# EAGLE design Sram2FramAdapter (EAGLE 7.6.0)
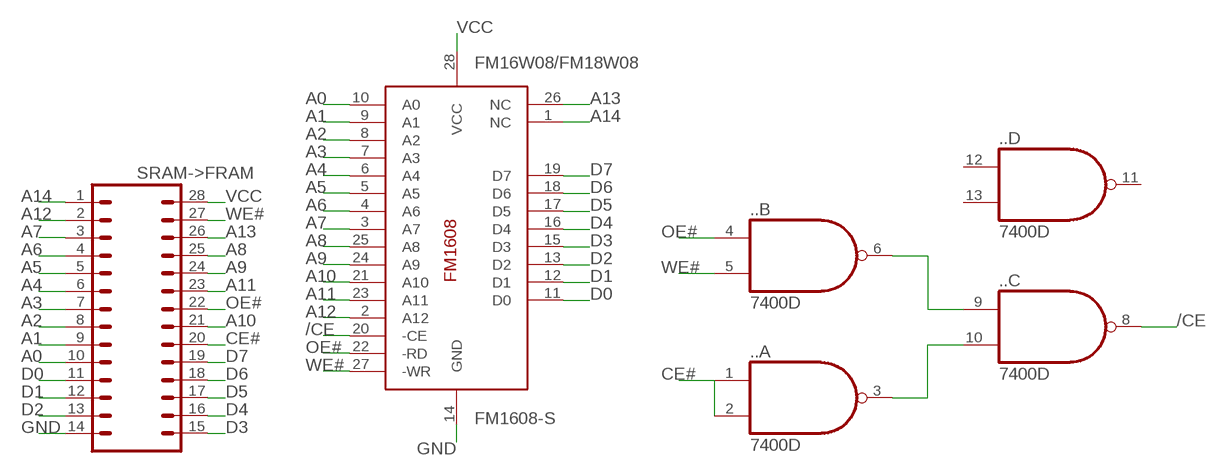
[diagram p0: schematic, sheet 1]

## Parts
..  7400D  [SO14]
FM16W08/FM18W08  FM1608-S  [SO-28W]
SRAM->FRAM  DIP28PTH  [DIP28]

## Nets
/CE: ...8(C:O) FM16W08/FM18W08.20(-CE)
A0: FM16W08/FM18W08.10(A0) SRAM->FRAM.10
A1: FM16W08/FM18W08.9(A1) SRAM->FRAM.9
A2: FM16W08/FM18W08.8(A2) SRAM->FRAM.8
A3: FM16W08/FM18W08.7(A3) SRAM->FRAM.7
A4: FM16W08/FM18W08.6(A4) SRAM->FRAM.6
A5: FM16W08/FM18W08.5(A5) SRAM->FRAM.5
A6: FM16W08/FM18W08.4(A6) SRAM->FRAM.4
A7: FM16W08/FM18W08.3(A7) SRAM->FRAM.3
A8: FM16W08/FM18W08.25(A8) SRAM->FRAM.25
A9: FM16W08/FM18W08.24(A9) SRAM->FRAM.24
A10: FM16W08/FM18W08.21(A10) SRAM->FRAM.21
A11: FM16W08/FM18W08.23(A11) SRAM->FRAM.23
A12: FM16W08/FM18W08.2(A12) SRAM->FRAM.2
A13: FM16W08/FM18W08.26(NC) SRAM->FRAM.26
A14: FM16W08/FM18W08.1(NC) SRAM->FRAM.1
CE#: ...1(A:I0) ...2(A:I1) SRAM->FRAM.20
D0: FM16W08/FM18W08.11(D0) SRAM->FRAM.11
D1: FM16W08/FM18W08.12(D1) SRAM->FRAM.12
D2: FM16W08/FM18W08.13(D2) SRAM->FRAM.13
D3: FM16W08/FM18W08.15(D3) SRAM->FRAM.15
D4: FM16W08/FM18W08.16(D4) SRAM->FRAM.16
D5: FM16W08/FM18W08.17(D5) SRAM->FRAM.17
D6: FM16W08/FM18W08.18(D6) SRAM->FRAM.18
D7: FM16W08/FM18W08.19(D7) SRAM->FRAM.19
GND: FM16W08/FM18W08.14(GND) SRAM->FRAM.14
N$3: ...6(B:O) ...9(C:I0)
N$4: ...3(A:O) ...10(C:I1)
OE#: ...4(B:I0) FM16W08/FM18W08.22(-RD) SRAM->FRAM.22
VCC: FM16W08/FM18W08.28(VCC) SRAM->FRAM.28
WE#: ...5(B:I1) FM16W08/FM18W08.27(-WR) SRAM->FRAM.27
Unconnected: ...11(D:O) ...12(D:I0) ...13(D:I1)

## Power pins joined to a net without a drawn wire
GND: ...7(P:GND)
VCC: ...14(P:VCC)

## Library data of the parts
.. = 74xx-us:74*00: Quad 2-input NAND gate
FM16W08/FM18W08 = ramtron:FM1608: FM1608 8k x 8 NVRAM 5V (Jedec) DIP/SO-28W
SRAM->FRAM = Adapter_DIP28:DIP28: 1x16 .1" header

## Board
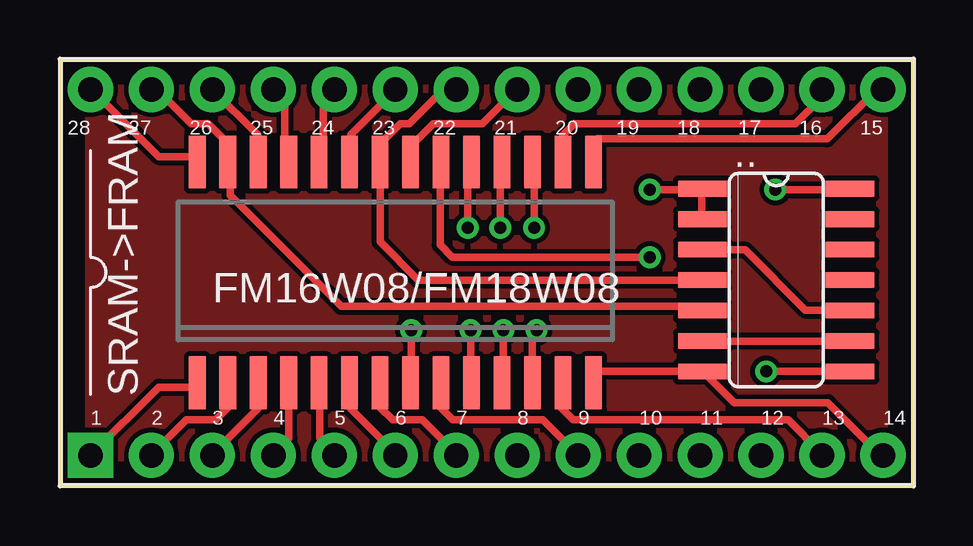
[diagram p1: board, top side]
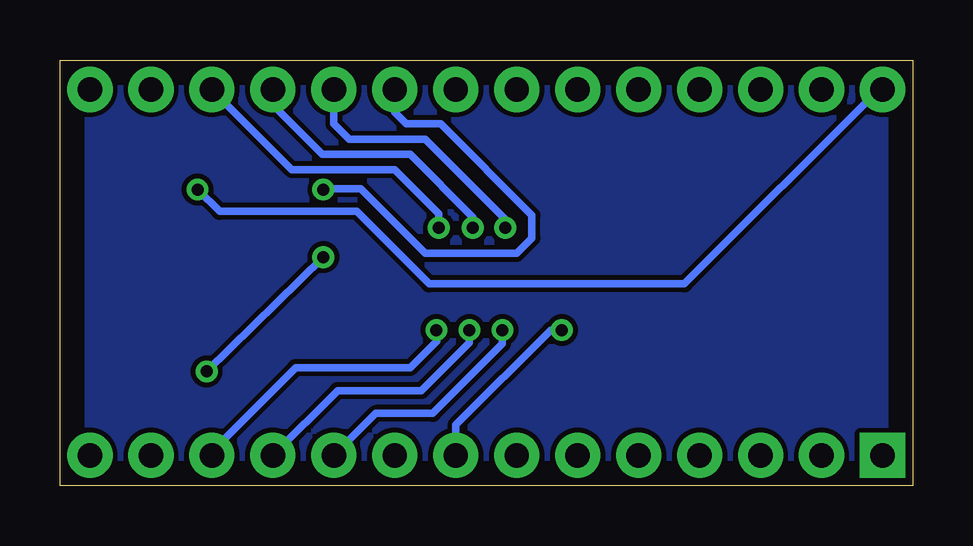
[diagram p2: board, bottom side, seen from below]

Size 35.54 x 17.74 mm. Coordinates in mm from the lower left corner, seen from the top.
Outline: 0,0 35.54,0 35.54,17.74 0,17.74 0,0
Copper layers (1*16): Top 0.035mm / dielectric 1.5mm / Bottom 0.035mm
Design rules "default": minimum track width 10mil, minimum drill 24mil, track to track 8mil, track to pad 8mil, pad to pad 8mil, via to via 8mil, smd to smd 8mil, copper to edge 40mil, drill to drill 8mil, minimum pad ring 10mil, minimum via ring 8mil, stop-mask expansion 4mil, vias tented up to drill 0mil, thermal gap 10mil

### Footprints (pad centres in the part's own frame; a part is rotated, then mirrored left to right if it is on the bottom)
SO14 = smd 0.66 x 2.032: 1 -3.81,-3.073; 2 -2.54,-3.073; 3 -1.27,-3.073; 4 0,-3.073; 5 1.27,-3.073; 6 2.54,-3.073; 7 3.81,-3.073; 8 3.81,3.073; 9 2.54,3.073; 10 1.27,3.073; 11 0,3.073; 12 -1.27,3.073; 13 -2.54,3.073; 14 -3.81,3.073
SO-28W = smd 0.7 x 2.2: 1 -8.255,-4.6; 2 -6.985,-4.6; 3 -5.715,-4.6; 4 -4.445,-4.6; 5 -3.175,-4.6; 6 -1.905,-4.6; 7 -0.635,-4.6; 8 0.635,-4.6; 9 1.905,-4.6; 10 3.175,-4.6; 11 4.445,-4.6; 12 5.715,-4.6; 13 6.985,-4.6; 14 8.255,-4.6; 15 8.255,4.6; 16 6.985,4.6; 17 5.715,4.6; 18 4.445,4.6; 19 3.175,4.6; 20 1.905,4.6; 21 0.635,4.6; 22 -0.635,4.6; 23 -1.905,4.6; 24 -3.175,4.6; 25 -4.445,4.6; 26 -5.715,4.6; 27 -6.985,4.6; 28 -8.255,4.6
DIP28 = drill 1.016 pad 1.88 square: 1 0,0 | drill 1.016 pad 1.88: 2 2.54,0; 3 5.08,0; 4 7.62,0; 5 10.16,0; 6 12.7,0; 7 15.24,0; 8 17.78,0; 9 20.32,0; 10 22.86,0; 11 25.4,0; 12 27.94,0; 13 30.48,0; 14 33.02,0; 15 33.02,15.24; 16 30.48,15.24; 17 27.94,15.24; 18 25.4,15.24; 19 22.86,15.24; 20 20.32,15.24; 21 17.78,15.24; 22 15.24,15.24; 23 12.7,15.24; 24 10.16,15.24; 25 7.62,15.24; 26 5.08,15.24; 27 2.54,15.24; 28 0,15.24

### Placement (x,y rotation side)
..  29.84,8.57 270 top
FM16W08/FM18W08  13.97,8.89 0 top
SRAM->FRAM  1.27,1.27 0 top

### Tracks (layer width: path | path; a pad name or v marks a point on that pad's centre or on a via)
/CE  (via drill 0.5)
  Top 0.305: FM16W08/FM18W08.20 15.84,13.49 15.84,10.03 16.35,9.53 v24.57,9.53 | v29.43,4.76 ...8
  Bottom 0.305: v24.57,9.53 v29.43,4.76
A0  (via drill 0.5)
  Top 0.305: FM16W08/FM18W08.10 17.11,4.29 v17.11,6.49
  Bottom 0.305: v17.11,6.49 17.11,5.91 20,3.02 22.38,3.02 SRAM->FRAM.10
A1
  Top 0.305: SRAM->FRAM.9 20.12,2.74 16.37,2.74 15.84,3.27 15.84,4.27 FM16W08/FM18W08.9
A2  (via drill 0.5)
  Top 0.305: v14.63,6.49 14.63,4.34 FM16W08/FM18W08.8
  Bottom 0.305: v14.63,6.49 15.1,6.49 19.05,2.54 SRAM->FRAM.8
A3
  Top 0.305: FM16W08/FM18W08.7 13.33,3.48 13.33,3.27 13.86,2.74 15.09,2.74 16.46,1.37 SRAM->FRAM.7
A4
  Top 0.305: FM16W08/FM18W08.6 12.12,4.12 12.12,3.2 13.95,1.37 SRAM->FRAM.6
A5
  Top 0.305: FM16W08/FM18W08.5 10.81,4.12 10.81,1.99 11.43,1.37 SRAM->FRAM.5
A6
  Top 0.305: FM16W08/FM18W08.4 9.53,4.12 9.53,1.99 8.91,1.37 SRAM->FRAM.4
A7
  Top 0.305: FM16W08/FM18W08.3 8.23,4.12 8.23,3.2 6.4,1.37 SRAM->FRAM.3
A8
  Top 0.305: FM16W08/FM18W08.25 9.37,13.72 9.37,16 8.91,16.46 SRAM->FRAM.25
A9
  Top 0.305: FM16W08/FM18W08.24 10.97,13.72 10.97,16 11.43,16.46 SRAM->FRAM.24
A10
  Top 0.305: FM16W08/FM18W08.21 14.63,13.72 14.63,14.17 15.54,15.09 17.6,15.09 18.97,16.46 SRAM->FRAM.21
A11
  Top 0.305: FM16W08/FM18W08.23 12.12,13.72 12.12,14.63 13.95,16.46 SRAM->FRAM.23
A12
  Top 0.305: FM16W08/FM18W08.2 6.86,4.12 7.02,3.27 6.49,2.74 5.26,2.74 3.89,1.37 SRAM->FRAM.2
A13
  Top 0.305: SRAM->FRAM.26 8.23,14.63 8.23,13.72 FM16W08/FM18W08.26
A14
  Top 0.305: SRAM->FRAM.1 4.12,4.12 5.71,4.12 FM16W08/FM18W08.1
CE#  (via drill 0.5)
  Top 0.305: 26.75,12.34 26.75,11.2 ...2 | 26.75,12.34 ...1 | 26.75,12.34 v24.57,12.34
  Bottom 0.305: SRAM->FRAM.20 21.59,15.56 21.11,15.08 19.68,15.08 15.88,11.27 15.88,10.32 16.51,9.68 20.32,9.68 23.02,12.38 24.53,12.38 v24.57,12.34
D0  (via drill 0.5)
  Top 0.305: FM16W08/FM18W08.11 18.52,4.34 18.48,4.34 v18.48,6.49
  Bottom 0.305: v18.48,6.49 18.48,5.97 20.48,3.97 23.97,3.97 SRAM->FRAM.11
D1  (via drill 0.5)
  Top 0.305: FM16W08/FM18W08.12 19.89,4.34 19.89,5.04 19.68,5.24 19.68,6.32 v19.86,6.49
  Bottom 0.305: SRAM->FRAM.12 29.21,1.43 25.72,4.92 20.95,4.92 19.84,6.03 19.84,6.48 v19.86,6.49
D2
  Top 0.305: SRAM->FRAM.13 31.71,1.37 30.33,2.74 21.39,2.74 20.8,3.33 FM16W08/FM18W08.13
D3
  Top 0.305: FM16W08/FM18W08.15 22.39,14.45 31.97,14.45 34.02,16.51 SRAM->FRAM.15
D4
  Top 0.305: SRAM->FRAM.16 31.75,16.19 30.64,15.08 21.43,15.08 20.95,14.61 FM16W08/FM18W08.16
D5  (via drill 0.5)
  Top 0.305: 19.89,13.49 FM16W08/FM18W08.17 19.75,13.42 v19.75,10.75
  Bottom 0.305: v19.75,10.75 19.75,11.34 21.59,13.18 25.88,13.18 SRAM->FRAM.17
D6  (via drill 0.5)
  Top 0.305: 18.52,13.49 FM16W08/FM18W08.18 18.34,13.41 v18.34,10.75
  Bottom 0.305: v18.34,10.75 18.34,11.2 20.95,13.81 24.61,13.81 26.67,15.88 SRAM->FRAM.18
D7  (via drill 0.5)
  Top 0.305: v16.99,10.75 16.99,13.33 FM16W08/FM18W08.19
  Bottom 0.305: SRAM->FRAM.19 24.13,15.08 23.5,14.45 20.32,14.45 16.99,11.11 v16.99,10.75
GND
  Top 0.305: 22.4,4.34 FM16W08/FM18W08.14 22.22,4.76 ...7 28.09,3.46 31.99,3.46 34.08,1.37 34.29,1.37 SRAM->FRAM.14
N$1
  pour Top: 0,0 35.56,0 35.56,17.78 0,17.78
N$2
  pour Bottom: 0,0 35.56,0 35.56,17.78 0,17.78
N$3
  Top 0.305: ...9 ...6
N$4
  Top 0.305: ...10 32.92,7.32 31.06,7.32 28.54,9.83 26.98,9.83 ...3
OE#
  Top 0.305: SRAM->FRAM.22 16.46,16.46 15.93,16.46 14.56,15.09 14.17,15.09 13.49,14.4 13.49,13.72 FM16W08/FM18W08.22 13.34,10.16 14.92,8.57 ...4
VCC  (via drill 0.5)
  Top 0.305: v29.81,12.34 32.92,12.34 ...14 | FM16W08/FM18W08.28 5.71,13.72 4.12,13.72 1.37,16.46 SRAM->FRAM.28
  Bottom 0.305: v29.81,12.34 28.89,11.43 23.18,11.43 20.16,8.41 9.53,8.41 1.43,16.51 SRAM->FRAM.28
WE#
  Top 0.305: ...5 26.75,7.47 11.71,7.47 7.09,12.1 7.09,13.49 FM16W08/FM18W08.27 6.86,13.72 6.86,14.4 6.17,15.09 5.47,15.09 4.1,16.46 3.89,16.46 SRAM->FRAM.27